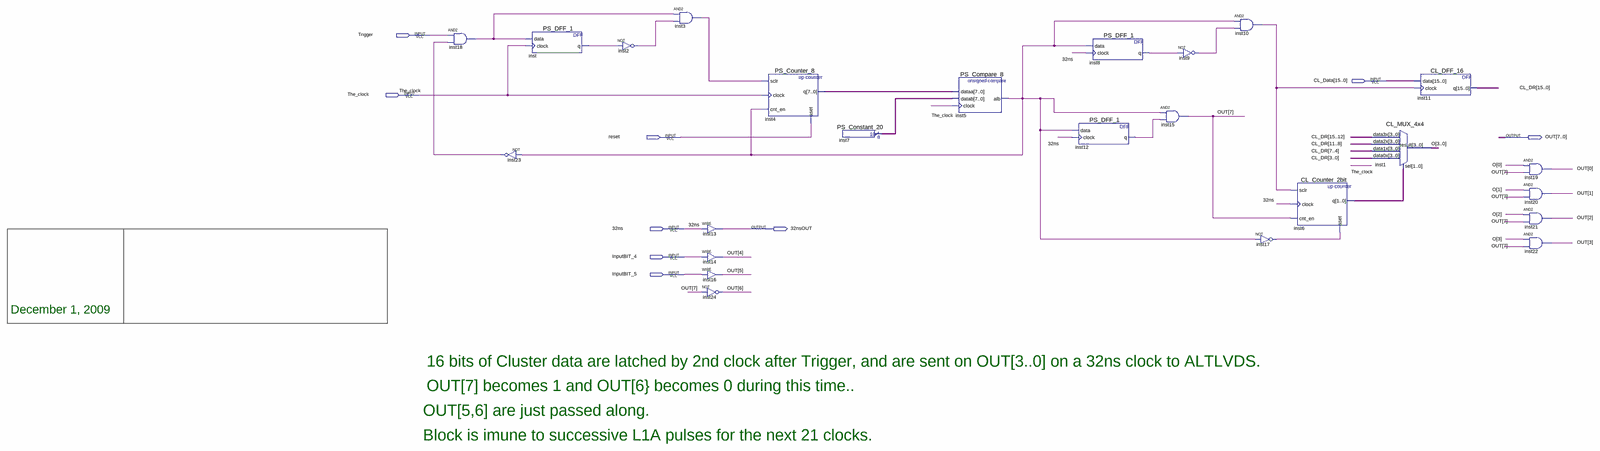
[diagram p0: schematic sheet, whole]
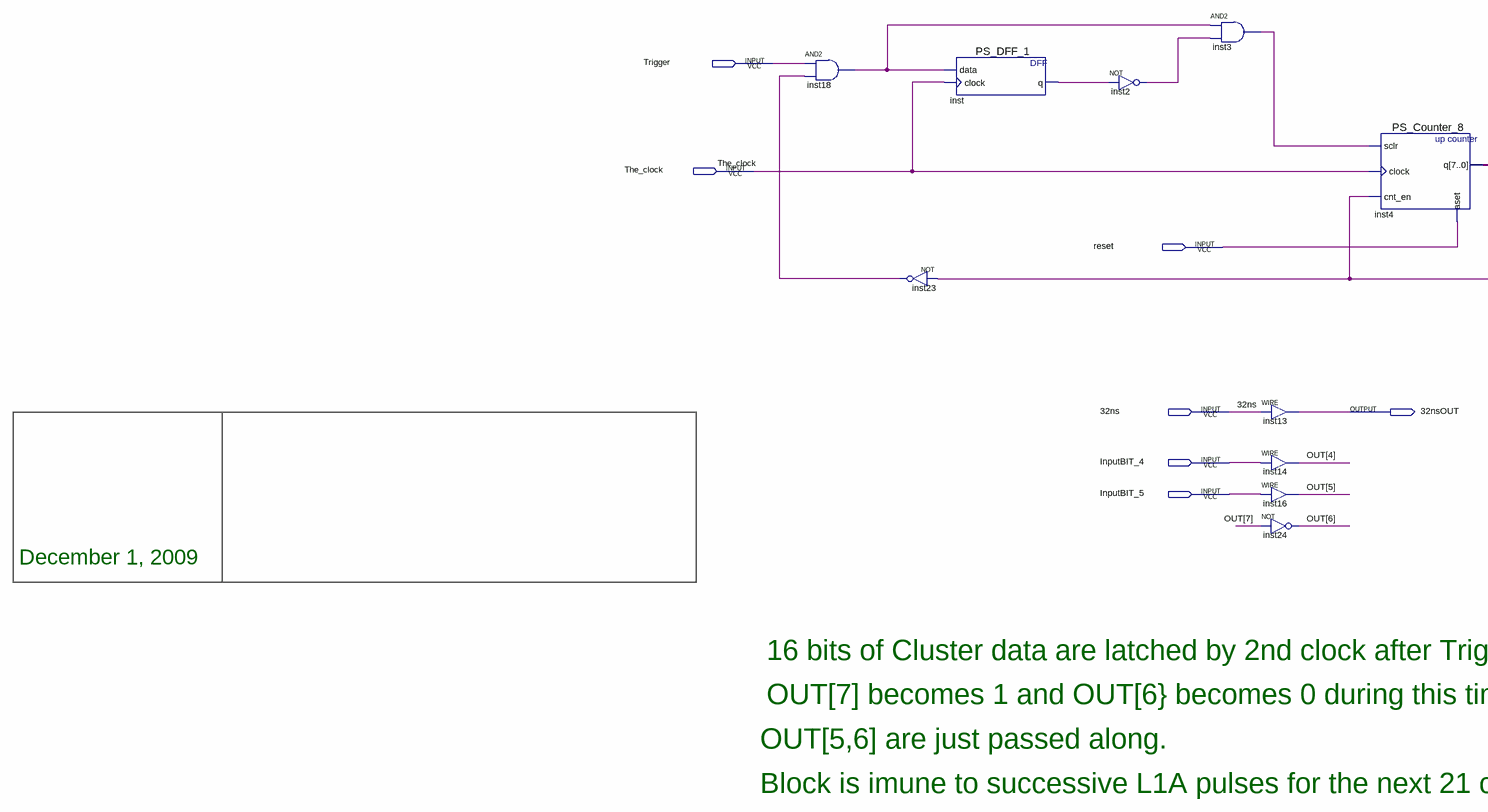
[diagram p1: schematic sheet, left part]
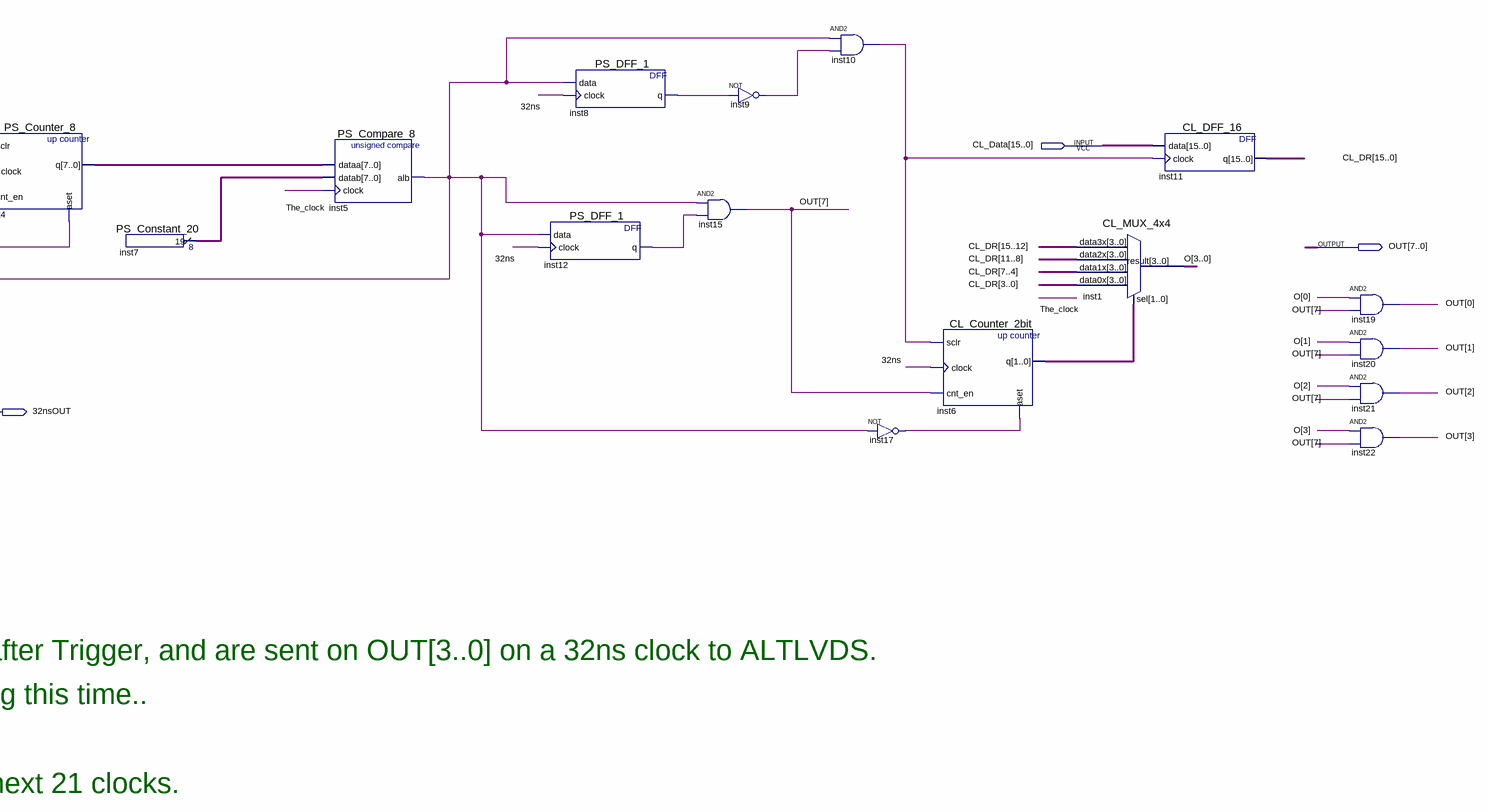
[diagram p2: schematic sheet, right part]
// Quartus schematic ALTLVDS_Input.bdf as structural Verilog: 25 symbols, 9 pins
module ALTLVDS_Input (
  input  Trigger,
  input  [15:0] CL_Data,
  input  The_clock,
  input  reset,
  input  \32ns ,
  input  InputBIT_4,
  input  InputBIT_5,
  output [7:0] OUT,
  output \32nsOUT 
);

  wire inst2_out, inst3_out, inst5_alb, inst8_q, inst9_out, inst10_out, inst12_q, inst17_out, inst18_out,
       inst23_out, inst_q;
  wire [1:0] inst6_q;
  wire [3:0] O;
  wire [7:0] inst4_q, inst7_result;
  wire [15:0] CL_DR;

  and inst18 (inst18_out, Trigger, inst23_out);
  not inst23 (inst23_out, inst5_alb);
  PS_DFF_1 inst (.data(inst18_out), .clock(The_clock), .q(inst_q));
  not inst2 (inst2_out, inst_q);
  and inst3 (inst3_out, inst18_out, inst2_out);
  assign \32nsOUT  = \32ns ;  // WIRE inst13
  assign OUT[4] = InputBIT_4;  // WIRE inst14
  assign OUT[5] = InputBIT_5;  // WIRE inst16
  not inst24 (OUT[6], OUT[7]);
  PS_Counter_8 inst4 (.sclr(inst3_out), .clock(The_clock), .cnt_en(inst5_alb), .aset(reset), .q(inst4_q));
  PS_Constant_20 inst7 (.result(inst7_result));
  PS_Compare_8 inst5 (.dataa(inst4_q), .datab(inst7_result), .clock(The_clock), .alb(inst5_alb));
  PS_DFF_1 inst8 (.data(inst5_alb), .clock(\32ns ), .q(inst8_q));
  PS_DFF_1 inst12 (.data(inst5_alb), .clock(\32ns ), .q(inst12_q));
  not inst9 (inst9_out, inst8_q);
  and inst15 (OUT[7], inst5_alb, inst12_q);
  and inst10 (inst10_out, inst5_alb, inst9_out);
  not inst17 (inst17_out, inst5_alb);
  CL_Counter_2bit inst6 (.sclr(inst10_out), .clock(\32ns ), .cnt_en(OUT[7]), .aset(inst17_out), .q(inst6_q));
  CL_MUX_4x4 inst1 (
    .data3x(CL_DR[15:12]), .data2x(CL_DR[11:8]), .data1x(CL_DR[7:4]), .data0x(CL_DR[3:0]), .sel(inst6_q),
    .result(O));
  CL_DFF_16 inst11 (.data(CL_Data), .clock(inst10_out), .q(CL_DR));
  and inst19 (OUT[0], O[0], OUT[7]);
  and inst20 (OUT[1], O[1], OUT[7]);
  and inst21 (OUT[2], O[2], OUT[7]);
  and inst22 (OUT[3], O[3], OUT[7]);

  // Notes on the sheet:
  //   December 1, 2009
  //   16 bits of Cluster data are latched by 2nd clock after Trigger, and are sent on OUT[3..0] on a 32ns clock to ALTLVDS.
  //   OUT[7] becomes 1 and OUT[6} becomes 0 during this time..
  //   OUT[5,6] are just passed along.
  //   Block is imune to successive L1A pulses for the next 21 clocks.
endmodule
